# Altium schematic sheet DAQ_REV_B.SchDoc: USB DAQ block diagram
size A4; Date: 6.4.2015; Engineer: Matjaž Tome; DocumentNumber: 1; Revision: B; SheetNumber: 1; SheetTotal: 10; Project: USB DAQ
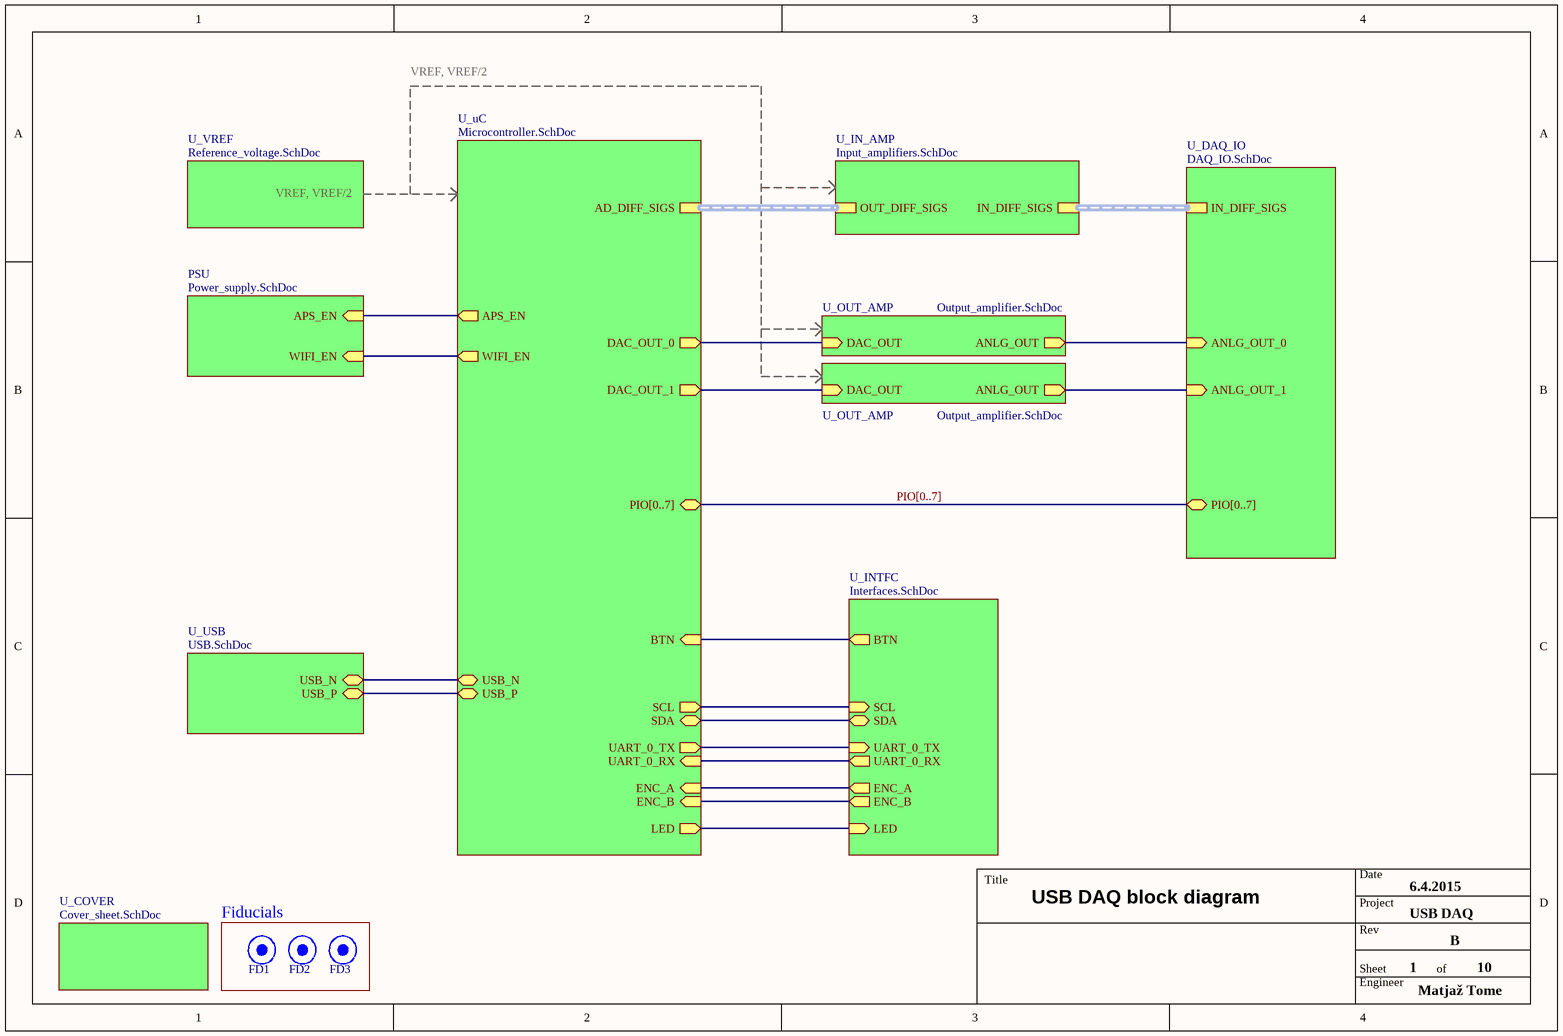
[diagram p0: DAQ_REV_B.SchDoc]

## Parts
FD1  Fiducial 1mm  [FID1]  (value not drawn)  (no BOM)
FD2  Fiducial 1mm  [FID1]  (value not drawn)  (no BOM)
FD3  Fiducial 1mm  [FID1]  (value not drawn)  (no BOM)

## Blocks framed on the sheet
Fiducials: FD1-FD3

## Sub-sheets
PSU = Power_supply.SchDoc: WIFI_EN (in), APS_EN (in)
U_COVER = Cover_sheet.SchDoc: no entries
U_DAQ_IO = DAQ_IO.SchDoc: ANLG_OUT_0 (in), ANLG_OUT_1 (in), IN_DIFF_SIGS (harness DIFF_SIGNALS), PIO[0..7] (bidir)
U_IN_AMP = Input_amplifiers.SchDoc: IN_DIFF_SIGS (harness DIFF_SIGNALS), OUT_DIFF_SIGS (harness DIFF_SIGNALS)
U_INTFC = Interfaces.SchDoc: BTN (out), SCL (in), SDA (bidir), UART_0_TX (in), UART_0_RX (out), ENC_A (out), ENC_B (out), LED (in)
U_OUT_AMP = Output_amplifier.SchDoc: ANLG_OUT (out), DAC_OUT (in)
U_OUT_AMP = Output_amplifier.SchDoc: ANLG_OUT (out), DAC_OUT (in)
U_uC = Microcontroller.SchDoc: USB_N (bidir), USB_P (bidir), DAC_OUT_0 (out), DAC_OUT_1 (out), APS_EN (out), UART_0_TX (out), UART_0_RX (in), SCL (out), SDA (bidir), ENC_A (in), ENC_B (in), WIFI_EN (out), BTN (in), LED (out), AD_DIFF_SIGS (harness DIFF_SIGNALS), PIO[0..7] (bidir)
U_USB = USB.SchDoc: USB_N (bidir), USB_P (bidir)
U_VREF = Reference_voltage.SchDoc: no entries

## Nets
(unnamed): sheet U_uC/USB_N, sheet U_USB/USB_N
(unnamed): sheet U_uC/USB_P, sheet U_USB/USB_P
(unnamed): sheet U_uC/DAC_OUT_0, sheet U_OUT_AMP/DAC_OUT
(unnamed): sheet U_uC/DAC_OUT_1, sheet U_OUT_AMP/DAC_OUT
(unnamed): sheet U_uC/APS_EN, sheet PSU/APS_EN
(unnamed): sheet U_uC/UART_0_TX, sheet U_INTFC/UART_0_TX
(unnamed): sheet U_uC/UART_0_RX, sheet U_INTFC/UART_0_RX
(unnamed): sheet U_uC/SCL, sheet U_INTFC/SCL
(unnamed): sheet U_uC/SDA, sheet U_INTFC/SDA
(unnamed): sheet U_uC/ENC_A, sheet U_INTFC/ENC_A
(unnamed): sheet U_uC/ENC_B, sheet U_INTFC/ENC_B
(unnamed): sheet U_uC/WIFI_EN, sheet PSU/WIFI_EN
(unnamed): sheet U_uC/BTN, sheet U_INTFC/BTN
(unnamed): sheet U_uC/LED, sheet U_INTFC/LED
(unnamed): sheet U_DAQ_IO/ANLG_OUT_0, sheet U_OUT_AMP/ANLG_OUT
(unnamed): sheet U_DAQ_IO/ANLG_OUT_1, sheet U_OUT_AMP/ANLG_OUT

## Buses and harness runs
bus PIO[0..7] = sheet U_DAQ_IO/PIO[0..7] = sheet U_uC/PIO[0..7]
harness sheet U_DAQ_IO/IN_DIFF_SIGS = sheet U_IN_AMP/IN_DIFF_SIGS
harness sheet U_IN_AMP/OUT_DIFF_SIGS = sheet U_uC/AD_DIFF_SIGS

## Notes on the sheet
- VREF, VREF/2
- Title
- Date
- Project
- Rev
- Engineer
- Sheet
- of

## Library data of the parts
FD1-FD3 = FIDUCIAL: Part Number: XXC0016; Category: Fiducials